# EAGLE design irisc (EAGLE 9.2.2)

## Sheet 1 of 2
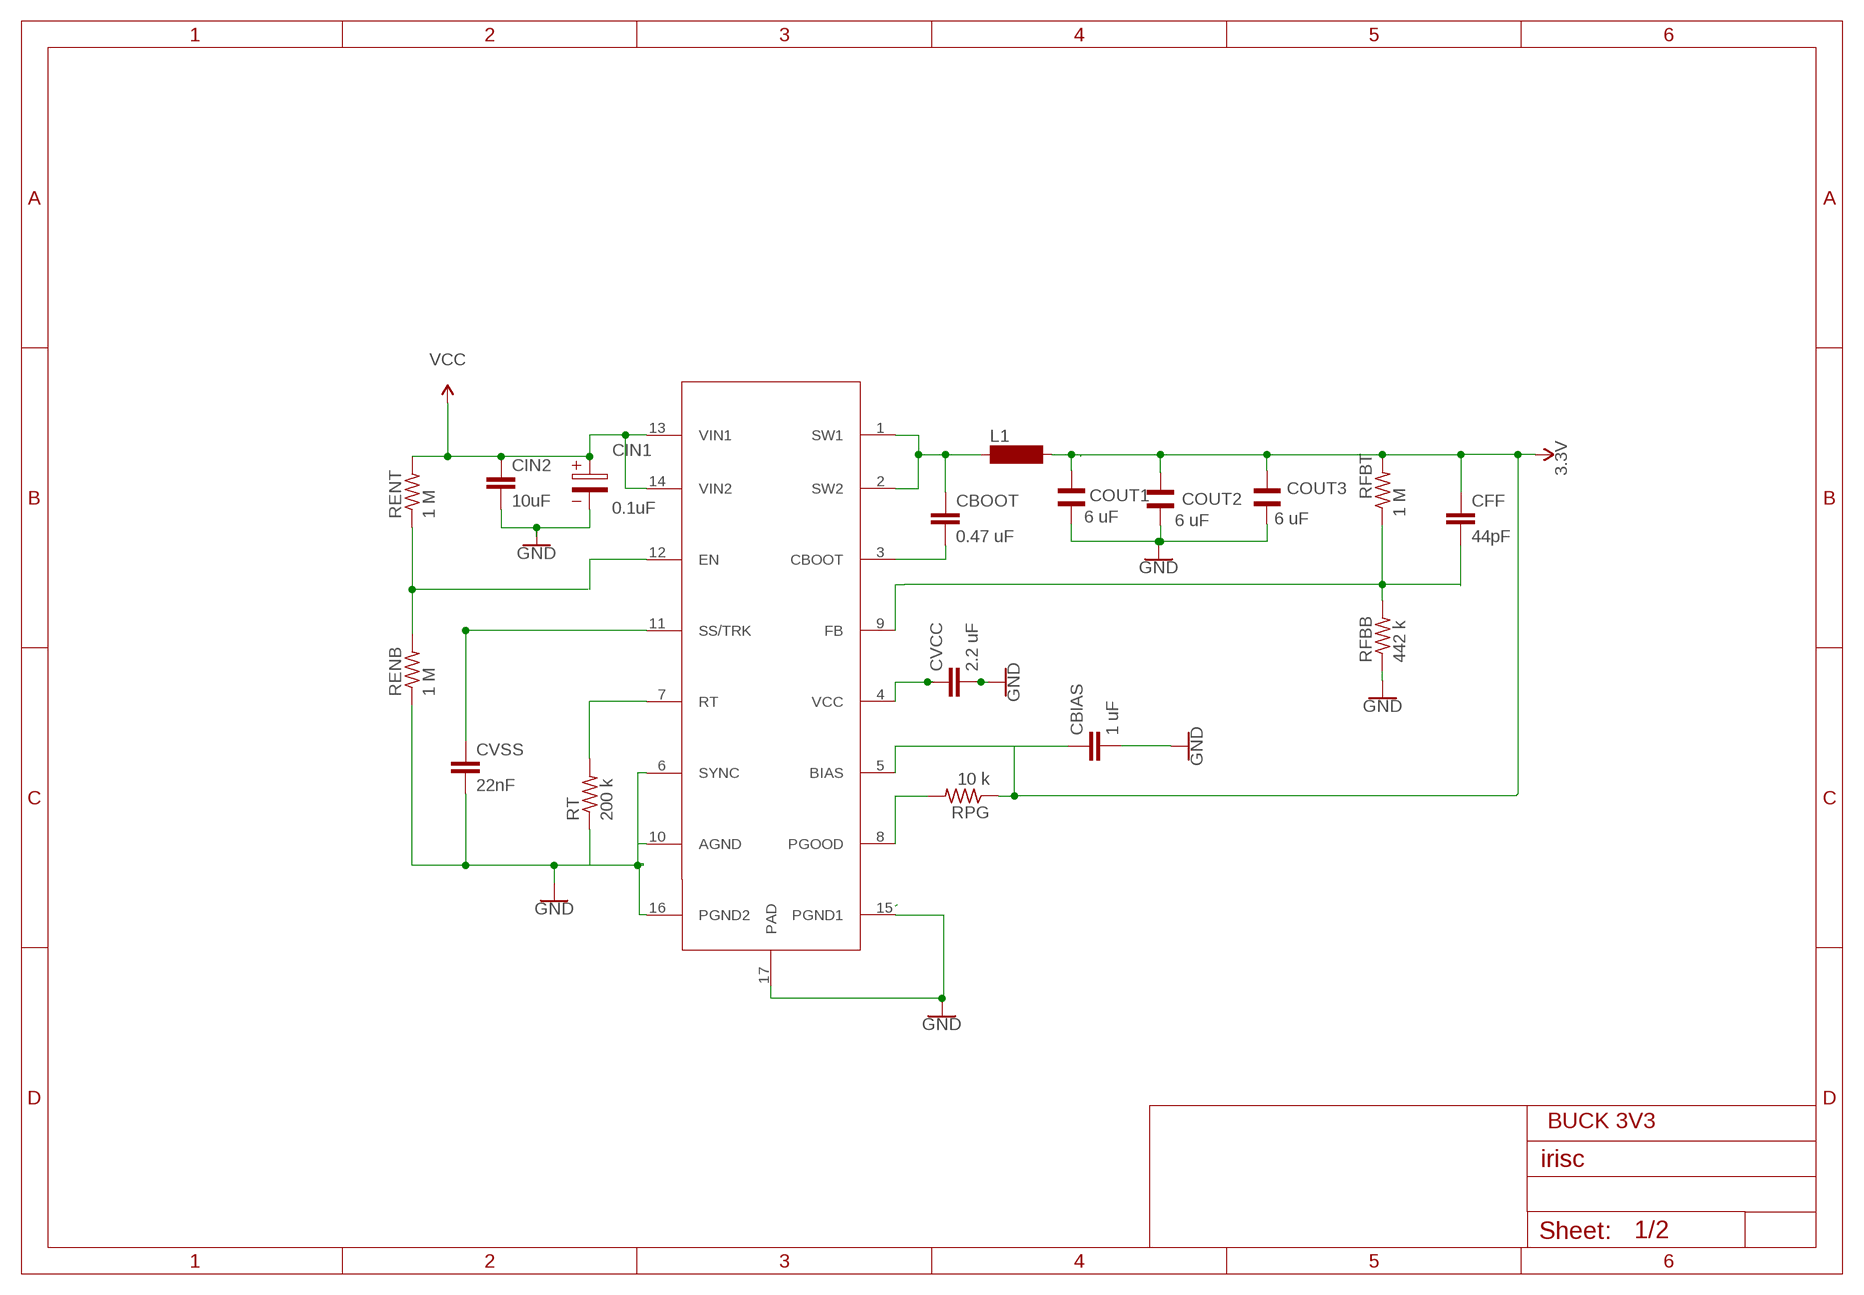
[diagram p0: schematic, sheet 1]

### Parts
BUCK3V1  BUCK3V3  [SOP65P640X120-17N]
CBIAS  1 uF  CC1210  [C1210]
CBOOT  0.47 uF  CC1210  [C1210]
CFF  44pF  CC0603  [C0603]
CIN1  0.1uF  WCAP-PTHR_6,3X8_870055673001  [6.3X2.5X0.9(DXAXB)]
CIN2  10uF  C  [C0805]
COUT1  6 uF  WCAP-CSGP_0805_885012006018_WAVE  [WCAP-CSGP_0805_WAVE]
COUT2  6 uF  WCAP-CSGP_0805_885012006018_WAVE  [WCAP-CSGP_0805_WAVE]
COUT3  6 uF  WCAP-CSGP_0805_885012006018_WAVE  [WCAP-CSGP_0805_WAVE]
CVCC  2.2 uF  CC1210  [C1210]
CVSS  22nF  CC1206  [C1206]
L1  BS11  [BS11]
RENB  1 M  FLIPFLOP-RES  [0805-THM]
RENT  1 M  FLIPFLOP-RES  [0805-THM]
RFBB  442 k  FLIPFLOP-RES  [0805-THM]
RFBT  1 M  FLIPFLOP-RES  [0805-THM]
RPG  10 k  FLIPFLOP-RES  [0805-THM]
RT  200 k  FLIPFLOP-RES  [0805-THM]

### Nets
3.3V: BUCK3V1.5(BIAS) CBIAS.1 CFF.1 COUT1.2 COUT2.2 COUT3.2 L1.2 RFBT.2 RPG.1
GND: CBIAS.2 CIN1.2 CIN2.2 COUT1.1 COUT2.1 COUT3.1 CVCC.2 RFBB.1 ; also sheet 2
N$1: BUCK3V1.1(SW1) BUCK3V1.2(SW2) CBOOT.1 L1.1
N$2: BUCK3V1.7(RT) RT.2
N$3: BUCK3V1.11(SS/TRK) CVSS.1
N$4: BUCK3V1.3(CBOOT) CBOOT.2
N$6: BUCK3V1.9(FB)
N$8: CFF.2 RFBB.2 RFBT.1
N$9: BUCK3V1.12(EN)
N$12: BUCK3V1.4(VCC) CVCC.1
N$13: BUCK3V1.8(PGOOD) RPG.2
N$130: RENB.2 RENT.1
PGND1: BUCK3V1.15(PGND1) BUCK3V1.17(PAD) ; supply symbol labelled GND
PGND2: BUCK3V1.6(SYNC) BUCK3V1.10(AGND) BUCK3V1.16(PGND2) CVSS.2 RENB.1 RT.1 ; supply symbol labelled GND
VCC1: BUCK3V1.13(VIN1) BUCK3V1.14(VIN2) CIN1.1 CIN2.1 RENT.2 ; supply symbol labelled VCC

### Notes on the sheet
- BUCK 3V3

## Sheet 2 of 2
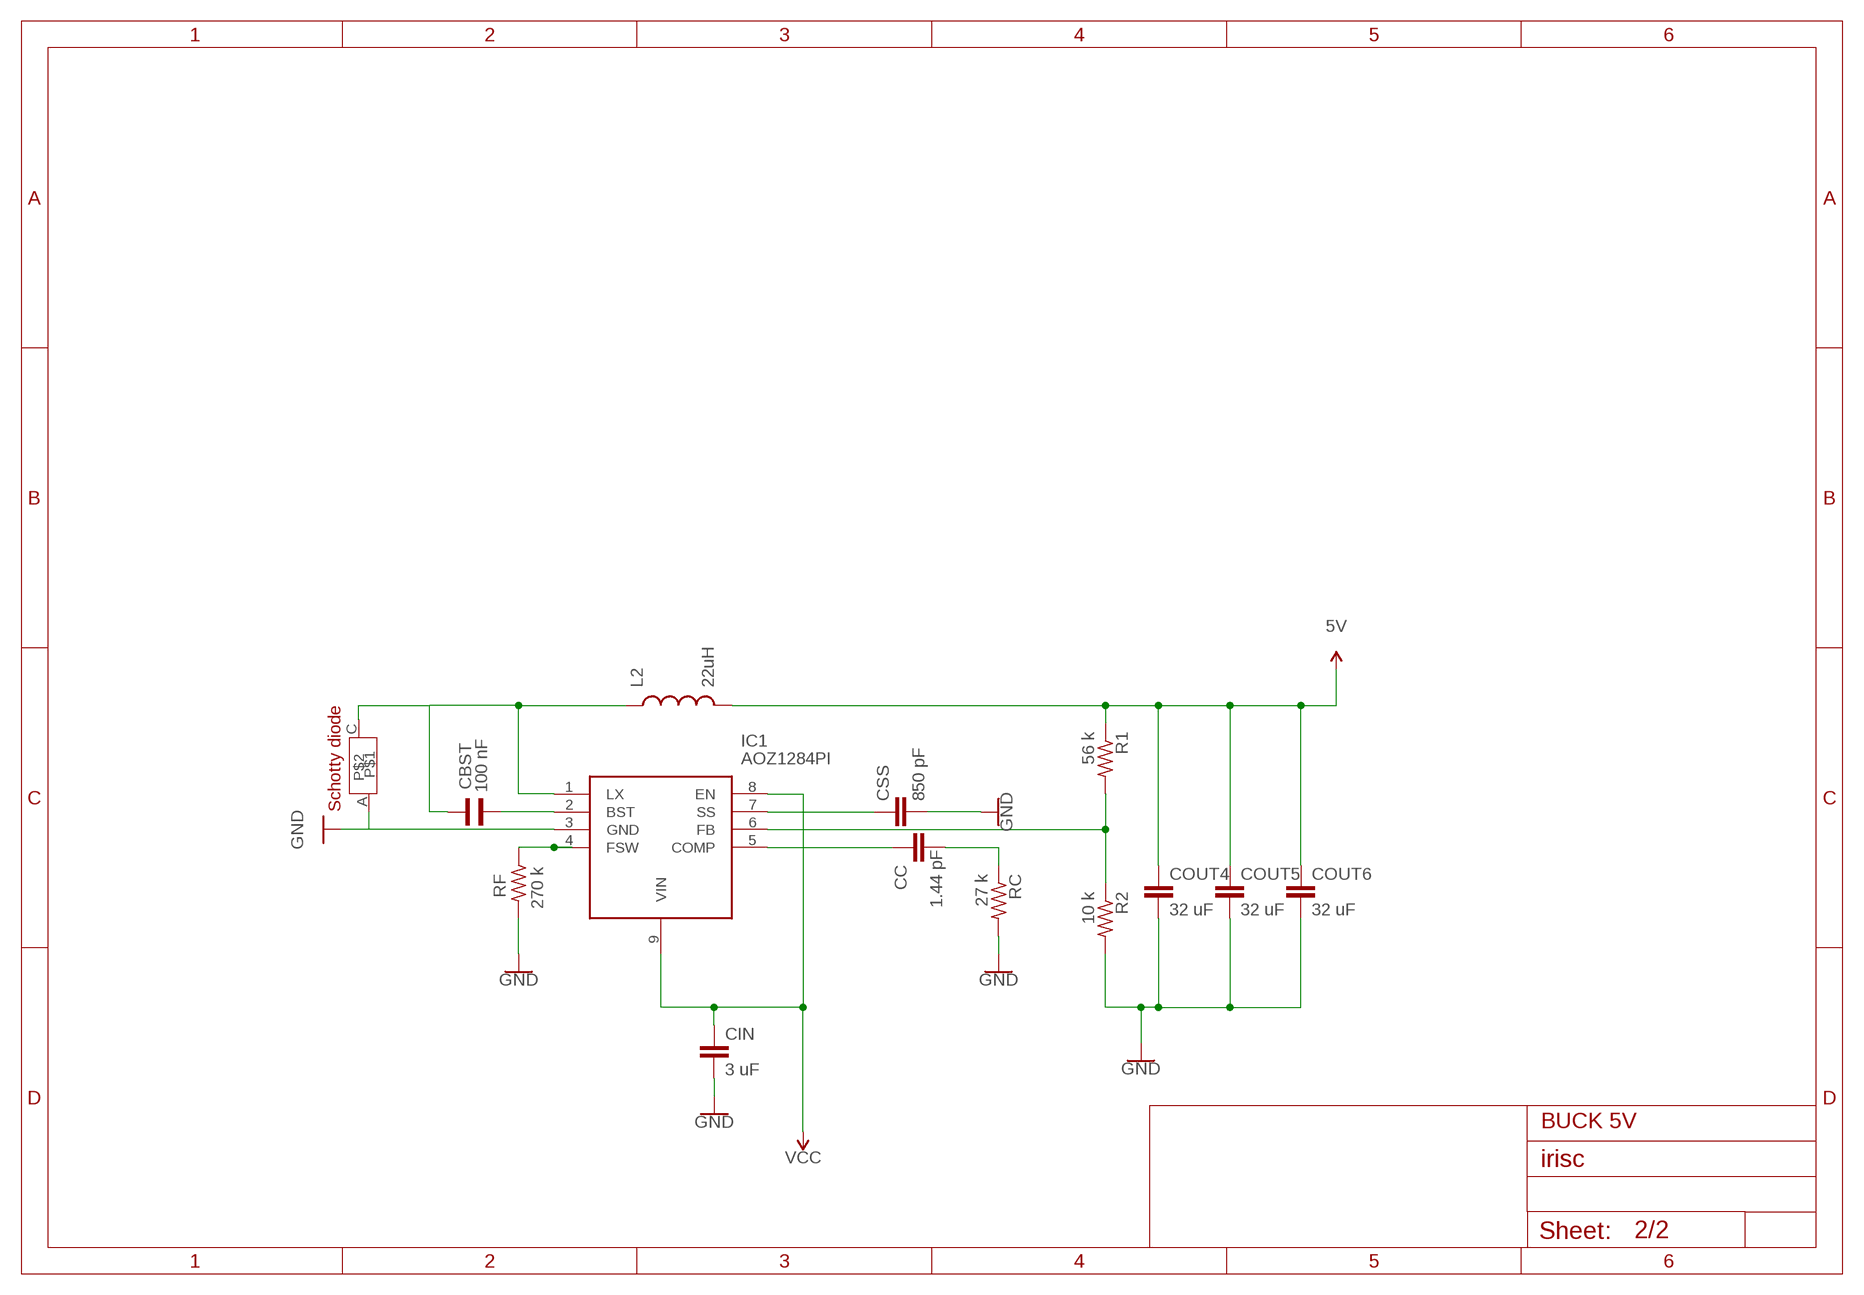
[diagram p1: schematic, sheet 2]

### Parts
CBST  100 nF  WCAP-CSGP_0805_885012006018_WAVE  [WCAP-CSGP_0805_WAVE]
CC  1.44 pF  CC1206  [C1206]
CIN  3 uF  CC1210  [C1210]
COUT4  32 uF  CC1812  [C1812]
COUT5  32 uF  CC1812  [C1812]
COUT6  32 uF  CC1812  [C1812]
CSS  850 pF  C  [C0805]
IC1  AOZ1284PI  [SOIC127P600X170-9N]
L2  22uH  INDUCTOR  [L0603]
R1  56 k  FLIPFLOP-RES  [0805-THM]
R2  10 k  FLIPFLOP-RES  [0805-THM]
RC  27 k  FLIPFLOP-RES  [0805-THM]
RF  270 k  FLIPFLOP-RES  [0805-THM]
U$1  SCHOTTY-DIODE-IRISC  [DO-214AC]

### Nets
5V: COUT4.1 COUT5.1 COUT6.1 L2.2 R1.1
GND: CIN.2 COUT4.2 COUT5.2 COUT6.2 CSS.2 IC1.3(GND) R2.2 RC.2 RF.2 U$1.A ; also sheet 1
N$5: IC1.4(FSW) RF.1
N$11: CBST.2 IC1.2(BST)
N$14: CBST.1 IC1.1(LX) L2.1 U$1.C
N$15: CC.1 IC1.5(COMP)
N$16: CSS.1 IC1.7(SS)
N$140: IC1.6(FB) R1.2 R2.1
N$141: CC.2 RC.1
VCC: CIN.1 IC1.8(EN) IC1.9(VIN)

### Notes on the sheet
- BUCK 5V

## Library data of the parts
BUCK3V1 = SOP65P640X120-17N:BUCK3V3: USED FOR IRISC - step down to 3V3
CBIAS CBOOT CC CFF CIN CIN2 COUT4-COUT6 CSS CVCC CVSS = eagle-ltspice:C: CAPACITOR, European symbol; SPICEMODEL: NONE; SPICEPREFIX: C
CBST COUT1-COUT3 = Wurth_Elektronik_Passive_Capacitors_rev18b:WCAP-CSGP_0805: WCAP-CSGP Ceramic Capacitors Characteristics Multilayer Ceramic Chip Capacitor Recommended soldering:Reflow, for 0603 and 0805 wave soldering is also allowed Operating temperature:-55 °C to +125 °C; Ceramic characteristics: Class I - NPO ; Class II -X7R, X5R High performance ceramic High capacitance stability Minimal aging Termination:Cu/Ni/Sn <http://katalog.we-online.de/media/images/eisos/WCAP-CSGP_pf2.jpg> Details see: http://katalog.we-online.de/en/pbs/WCAP-CSGP-0805? Created: 2015-01-28 2015 (C) Wurth Elektronik; SPICEPREFIX: C
CIN1 = Wurth_Elektronik_Passive_Capacitors_rev18b:WCAP-PTHR: WCAP-PTHR Aluminum Polymer Capacitors Characteristics Aluminum Polymer Capacitor Recommended soldering: Wave Operating temperature: -55°C to +105°C High reliability series Low ESR at high frequency range High permissible ripple current Load life: 2000h @ +105°C Package name and Variant abbreviation: Package: D X A X B = Diameter of the outline X Pitch of the hole X Diameter of the hole. Variant: D X L X P X Ø = Diameter of the body part X Height of the body part X Pitch of the pin X Diameter of the pin. <http://katalog.we-online.de/media/images/eisos/WCAP-PTHR_pf2.jpg> Details see: http://katalog.we-online.de/en/pbs/WCAP-PTHR/ Created: 2015-02-06 2015 (C) Wurth Elektronik; WE-NUMBER: 870055673001/10uF
IC1 = AOZ1284PI:AOZ1284PI: IC REG BUCK ADJ 4A 8SO Source: Datasheet <http://datasheet.octopart.com/AOZ1284PI-Alpha-&-Omega-Semiconductor-datasheet-68364838.pdf>; DESCRIPTION: IC REG BUCK ADJ 4A 8SO; HEIGHT: 1.7mm; MANUFACTURER_NAME: Alpha & Omega Semiconductors; MANUFACTURER_PART_NUMBER: AOZ1284PI
L1 = inductor-neosid:BS: INDUCTOR nominal inductance, magnetically screened; OC_FARNELL: unknown; OC_NEWARK: unknown
L2 = BeagleBone_Blue_R3:INDUCTOR: Inductors Basic Inductor/Choke - 0603 and 1206. Footprints are not proven and vary greatly between part numbers. SRN6045- 33uH, 20% 1.4A
R1 R2 RC RENB RENT RF RFBB RFBT RPG RT = adafruit:FLIPFLOP-RES: Flip Flop resistor An 0805 resistor inside a standard 1/4W 5% resistor. Makes for easy mods; SPICEPREFIX: R
U$1 = DO-214AC:SCHOTTY-DIODE-IRISC: Footprint : DO-214AB ,8 A, 60 V

## Board
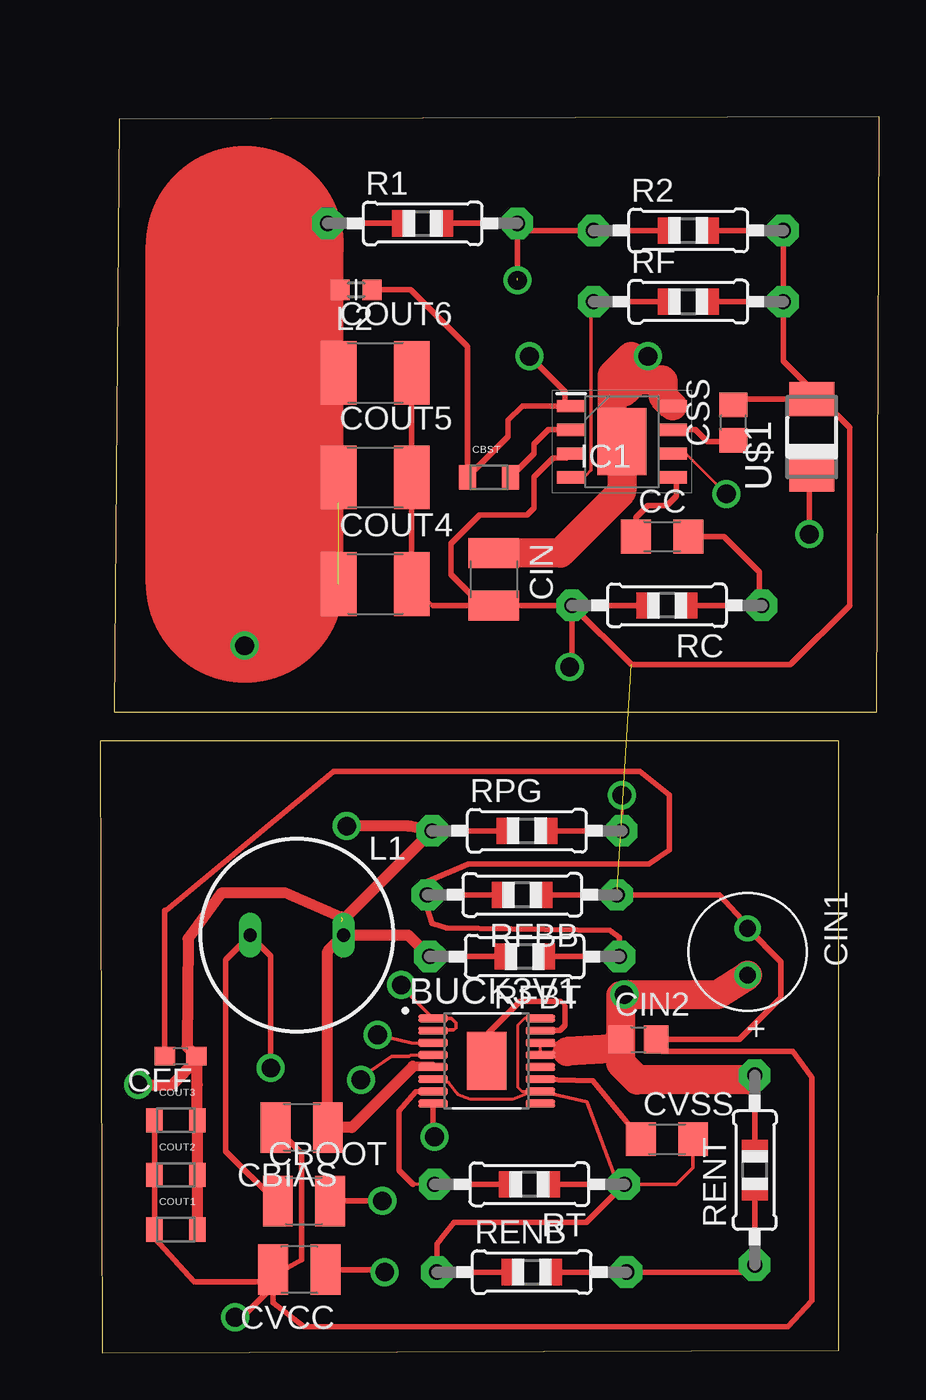
[diagram p2: board, top side]
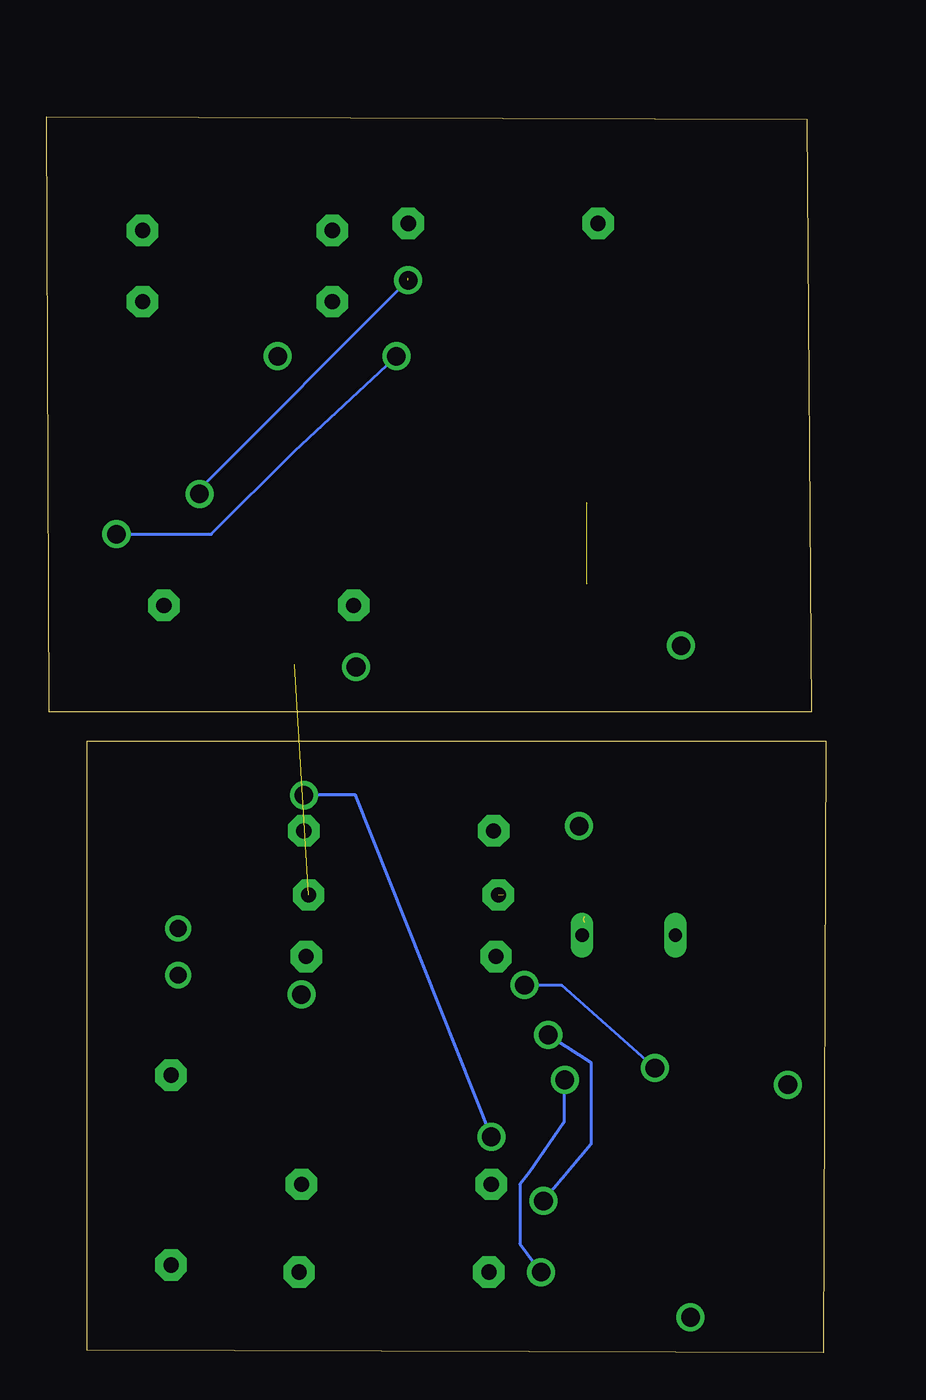
[diagram p3: board, bottom side, seen from below]

Size 41.71 x 66.16 mm. Coordinates in mm from the lower left corner, seen from the top.
Outline: 0.13,0 39.55,0.13 39.55,32.76 0,32.76 0.13,0
Outline: 0.76,34.29 41.58,34.29 41.71,66.16 1.02,66.03 0.76,34.29
Copper layers (1*16): Top 0.035mm / dielectric 1.5mm / Bottom 0.035mm
Design rules "default": minimum track width 6mil, minimum drill 0.35mm, track to track 6mil, track to pad 6mil, pad to pad 6mil, via to via 6mil, smd to smd 6mil, copper to edge 40mil, drill to drill 6mil, minimum pad ring 10mil, minimum via ring 8mil, stop-mask expansion 4mil, vias tented up to drill 0mil, thermal gap 10mil

### Footprints (pad centres in the part's own frame; a part is rotated, then mirrored left to right if it is on the bottom)
SOP65P640X120-17N = smd 1.57 x 0.41: 1 -2.87,2.275; 2 -2.87,1.625; 3 -2.87,0.975; 4 -2.87,0.325; 5 -2.87,-0.325; 6 -2.87,-0.975; 7 -2.87,-1.625; 8 -2.87,-2.275; 9 2.87,-2.275; 10 2.87,-1.625; 11 2.87,-0.975; 12 2.87,-0.325; 13 2.87,0.325; 14 2.87,0.975; 15 2.87,1.625; 16 2.87,2.275 | smd 2.105 x 3.115: 17 0,0
C1210 = smd 1.6 x 2.7: 1 -1.4,0; 2 1.4,0
WCAP-CSGP_0805_WAVE = smd 0.9 x 1.3: 1 -1.15,0; 2 1.15,0
C1206 = smd 1.6 x 1.8: 1 -1.4,0; 2 1.4,0
C0603 = smd 1.1 x 1: 1 -0.85,0; 2 0.85,0
6.3X2.5X0.9(DXAXB) = drill 0.9: 1 1.25,0; 2 -1.25,0
C0805 = smd 1.3 x 1.5: 1 -0.95,0; 2 0.95,0
C1812 = smd 1.9 x 3.4: 1 -1.95,0; 2 1.95,0
SOIC127P600X170-9N = smd 1.525 x 0.65: 1 -2.712,1.905; 2 -2.712,0.635; 3 -2.712,-0.635; 4 -2.712,-1.905; 5 2.712,-1.905; 6 2.712,-0.635; 7 2.712,0.635; 8 2.712,1.905 | smd 2.61 x 3.6: 9 0,0
BS11 = drill 0.7 long: 1 -2.5,0; 2 2.5,0
L0603 = smd 1 x 1.1: 1 -0.85,0; 2 0.85,0
0805-THM = drill 0.813 pad 1.676 octagon: 1 -5.08,0; 2 5.08,0
DO-214AC = smd 1.8 x 2.4: A 2.025,0; C -2.025,0

### Placement (x,y rotation side)
BUCK3V1  20.7,15.62 0 top
CBIAS  10.79,12.06 180 top
CBOOT  10.92,8.13 0 top
CBST  20.83,46.86 0 top
CC  30.1,43.69 0 top
CFF  4.32,15.88 180 top
CIN  21.08,41.4 270 top
CIN1  34.67,21.46 270 top
CIN2  28.83,16.76 0 top
COUT1  4.06,6.6 0 top
COUT2  4.06,9.53 0 top
COUT3  4.06,12.45 0 top
COUT4  14.73,41.15 0 top
COUT5  14.73,46.86 0 top
COUT6  14.73,52.45 0 top
CSS  33.91,49.78 90 top
CVCC  10.67,4.45 180 top
CVSS  30.35,11.43 0 top
IC1  27.94,48.77 0 top
L1  10.54,22.35 0 top
L2  13.72,56.9 180 top
R1  17.27,60.45 0 top
R2  31.5,60.07 0 top
RC  30.35,40.01 180 top
RENB  23.11,4.32 0 top
RENT  35.05,9.78 90 top
RF  31.5,56.26 0 top
RFBB  22.61,24.51 180 top
RFBT  22.73,21.21 180 top
RPG  22.86,27.94 0 top
RT  22.99,9.02 180 top
U$1  38.1,49.02 90 top

### Tracks (layer width: path | path; a pad name or v marks a point on that pad's centre or on a via)
3.3V  (via drill 1)  (2 unrouted)
  Top 0.152: 17.78,15.24 BUCK3V1.5 17.79,15.33 | 5.21,14.35 5.21,14.38 | 12.91,23.33 12.91,21.19 | L1.2 13.03,22.79 12.99,23.19
  Top 0.501: 17.79,15.33 16.76,15.33
  Top 0.6: L1.2 12.2,21.51
  Top 0.601: COUT1.2 COUT2.2 COUT3.2 5.21,14.35 5.21,15.71 | 12.2,21.51 CBIAS.1 13.49,12.06 16.76,15.33 | 12.95,22.18 12.91,23.07 RPG.1 16.51,28.19 v13.21,28.19 | RFBT.2 16.51,22.35 L1.2 | 5.21,15.71 CFF.1 4.66,16.38 4.72,22.16 6.54,24.64 9.9,24.64 12.91,23.33 | v2.03,14.35 3.85,14.35 5.21,15.71
5V  (via drill 1)  (1 unrouted)
  Top 0.152: 12.78,45.51 12.19,46.1 12.19,46.27 COUT5.1 | 12.15,60.41 R1.1 9.27,60.45 8.13,59.31 | 13.34,52.7 13.08,52.45 COUT6.1 7.96,57.28 7.87,57.28 | COUT4.1 7.75,41.15 v7.75,37.85 | 8.13,59.31 10.45,59.31 L2.2 9.02,56.9 | 8.13,59.31 7.75,59.31 7.75,57.4 7.87,57.28 | 9.02,56.9 8.26,57.66 | 9.02,56.9 10.03,55.88 10.03,55.12 7.87,57.28
  Top 10.6: 7.75,41.15 7.75,59.31
GND  (via drill 1)  (1 unrouted)
  Top 0.152: 34.67,22.84 CIN1.2 | COUT1.1 2.91,6.12 | 9.27,3.81 CVCC.2 9.48,4.24 | 30.1,16.13 CIN2.2 | COUT4.2 17.83,40 | CIN.2 20.45,40 20.45,40.01 | IC1.3 24.97,47.88 | CSS.2 34.22,51.05 | 38.62,51.05 U$1.A | v7.24,1.91 7.62,1.91 | 25.27,36.83 v25.15,36.7
  Top 0.3: CIN2.2 34.22,16.76 36.45,18.99 36.45,20.93 CIN1.2 | COUT3.1 COUT2.1 COUT1.1 | 2.91,6.12 5.04,3.81 9.27,3.81 | CBIAS.2 10.79,10.67 10.79,4.99 9.48,4.24 | RFBB.1 33.16,24.51 34.67,22.84 | CVCC.2 9.27,3.56 | 9.27,3.56 9.27,2.68 10.92,1.4 36.83,1.4 38.1,2.79 38.1,14.73 37.08,16.13 30.1,16.13 | COUT6.2 COUT5.2 COUT4.2 | 17.83,40 20.45,40 | RC.2 CIN.2 | 24.97,47.88 24.26,47.88 23.24,46.86 23.24,45.21 22.86,44.83 20.32,44.83 18.8,43.31 18.8,41.66 20.45,40.01 | 34.22,51.05 U$1.A | RC.2 28.45,36.83 36.96,36.83 40.13,40.01 40.13,49.53 38.62,51.05 36.58,53.09 RF.2 R2.2 | 7.62,1.91 9.27,3.56 | RC.2 25.27,36.83
N$1  (via drill 1)
  Top 0.152: 19.05,17.4 18.92,17.27 | 17.86,17.27 BUCK3V1.2 | CBOOT.1 9.39,8.13
  Top 0.2: 19.05,17.4 19.05,17.65 18.81,17.9 BUCK3V1.1 16.11,19.62 v16.13,19.68 | 18.92,17.27 17.86,17.27 | 8.46,21.92 8.44,21.95 L1.1
  Top 0.3: L1.1 6.73,21.04 6.73,10.79 9.39,8.13 | v9.14,15.24 9.14,21.24 8.46,21.92
  Bottom 0.152: v16.13,19.68 14.14,19.68 v9.14,15.24
N$2
  Top 0.152: RT.2 16.76,9.02
  Top 0.3: BUCK3V1.7 16.89,13.97 16,12.95 16,9.78 16.76,9.02
N$3
  Top 0.3: BUCK3V1.11 26.39,14.57 CVSS.1
N$4  (via drill 1)
  Top 0.152: 16.65,16.6 BUCK3V1.3
  Top 0.2: v14.86,17.02 16.65,16.6
  Top 0.3: CBOOT.2 v15.11,8.13
  Bottom 0.152: v14.86,17.02 12.57,15.55 12.57,11.14 v15.11,8.13
N$5
  Top 0.152: IC1.4 25.36,46.99 26.04,46.99 26.28,47.23
  Top 0.2: 26.28,56.12 26.28,47.23
  Top 0.3: 26.28,56.12 RF.1
N$8  (1 unrouted)
  Top 0.152: 27.94,21.34 RFBT.1 | 17.25,24.54 17.48,24.77 17.65,24.77
  Top 0.3: CFF.2 3.47,23.68 3.55,23.68 12.5,31.11 28.89,31.11 30.48,29.84 30.48,26.92 29.38,26.16 19.73,26.16 17.53,25.22 RFBB.2 17.53,23.75 17.78,22.99 18.54,22.73 27.3,22.61 27.81,22.23 RFBT.1
N$11
  Top 0.3: CBST.2 23.24,48.13 23.24,48.64 24,49.4 IC1.2
N$12  (via drill 1)
  Top 0.152: 16.54,15.87 16.65,15.95 BUCK3V1.4
  Top 0.2: 16.54,15.87 15.6,15.87 14.39,15.03 v13.97,14.61 | 15.11,4.45 v15.24,4.32
  Top 0.3: 15.11,4.45 CVCC.1
  Bottom 0.152: v13.97,14.61 14.01,14.56 14.01,12.34 15.88,9.65 16.38,9.02 16.38,5.84 v15.24,4.32
N$13  (via drill 1)
  Top 0.152: v27.94,29.84 RPG.2 | v17.91,11.56 17.83,11.56
  Top 0.3: 17.83,11.56 BUCK3V1.8
  Bottom 0.152: v17.91,11.56 25.17,29.84 v27.94,29.84
N$14  (via drill 1)
  Top 0.152: L2.1 14.61,56.86 | IC1.1 24.89,51.01 | 37.97,46.87 U$1.C
  Top 0.3: v22.99,53.34 24.89,51.44 24.89,51.01 | v37.97,43.81 37.97,46.87 | L2.1 16.64,56.9 19.68,53.85 CBST.1 21.84,49.03 21.84,49.91 22.61,50.67 IC1.1
  Bottom 0.152: v37.97,43.81 32.89,43.81 28.45,48.26 23.11,53.21 v22.99,53.34
N$15
  Top 0.152: CC.1 28.7,44.7 | 30.86,46.65 IC1.5
  Top 0.3: 28.7,44.7 29.34,45.34 30.35,45.34 30.86,45.85 30.86,46.65
N$16
  Top 0.152: 33.84,48.77 CSS.1
  Top 0.3: IC1.7 31.88,49.4 32.51,48.77 33.84,48.77
N$130
  Top 0.152: RENT.1 34.67,4.32
  Top 0.3: 34.67,4.32 RENB.2
N$140  (via drill 1)  (1 unrouted)
  Top 0.152: IC1.6 31.37,48.13 v33.53,45.97 | R1.2 22.73,60.07
  Top 0.3: 22.73,60.07 R2.1 | R1.2 22.35,57.53
  Bottom 0.152: v33.53,45.97 33.53,46.23 v22.35,57.4
N$141
  Top 0.152: 35.31,40.13 RC.1
  Top 0.3: CC.2 33.4,43.69 35.31,41.78 35.31,40.13
PGND1
  Top 0.152: 24.89,18.54 24.64,18.8 | 20.7,17.02 BUCK3V1.17
  Top 0.3: BUCK3V1.15 24.61,17.25 24.89,17.53 24.89,18.54 | 20.7,17.02 22.48,18.8 24.64,18.8
PGND2
  Top 0.152: BUCK3V1.16 22.72,17.9 22.35,17.53 22.35,14.22 22.58,14 23.11,14 | 23.11,14 BUCK3V1.10 | BUCK3V1.6 18.67,14.48 19.18,13.84 19.81,13.59 22.1,13.59 23.11,14 | BUCK3V1.10 24.23,14 | BUCK3V1.10 23.61,14
  Top 0.2: CVSS.2 31.75,9.91 30.86,9.02 RT.1 28.05,9.02 27.8,8.79 26.07,13.42 23.61,14
  Top 0.3: RENB.1 18.03,5.84 18.95,6.99 26.04,6.99 RT.1
VCC  (via drill 1)
  Top 0.152: 30.14,52.02 30.1,52.07 | 28.07,51.44 28.07,48.9 IC1.9 27.43,49.28 | 28.45,53.34 v29.34,53.34
  Top 1.56: 30.14,52.02 30.14,51.18 IC1.8 | 30.1,52.07 28.7,52.07 28.07,51.44 | IC1.9 27.94,46.1 24.64,42.8 CIN.1 | 27.43,49.28 27.43,52.32 28.45,53.34
VCC1  (via drill 1)
  Top 0.152: 28.21,16.43 CIN2.1 27.69,16.58 | BUCK3V1.13 BUCK3V1.14 | BUCK3V1.14 24.04,16.6 24.13,16.51 | BUCK3V1.14 24.47,16.6 | v28.07,19.18 27.88,19.13 | 25.02,16.13 25.01,16.6 BUCK3V1.14
  Top 1.56: CIN2.1 27.88,15.49 28.77,14.61 34.8,14.61 RENT.2 | CIN2.1 27.88,19.13 | CIN1.1 33.07,19.18 v28.07,19.18 | CIN2.1 27.37,16.26 25.02,16.13